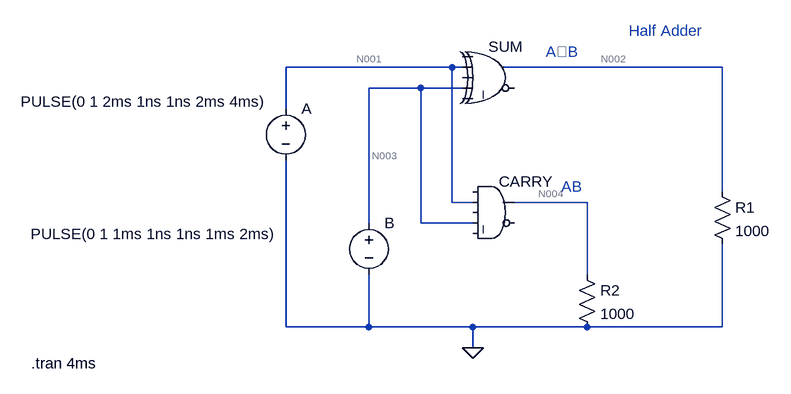
[diagram p0: schematic HALF ADDER_GOKUL.asc]
HALF ADDER_GOKUL.asc, the LTspice schematic file:
Version 4
SHEET 1 880 680
WIRE -64 -48 -320 -48
WIRE -48 -48 -64 -48
WIRE 352 -48 16 -48
WIRE -112 -16 -192 -16
WIRE -48 -16 -112 -16
WIRE -320 16 -320 -48
WIRE 352 144 352 -48
WIRE -64 160 -64 -48
WIRE -32 160 -64 160
WIRE 144 160 32 160
WIRE -192 192 -192 -16
WIRE -112 192 -112 -16
WIRE -32 192 -112 192
WIRE 144 272 144 160
WIRE -320 352 -320 96
WIRE -192 352 -192 272
WIRE -192 352 -320 352
WIRE -32 352 -192 352
WIRE 144 352 -32 352
WIRE 352 352 352 224
WIRE 352 352 144 352
WIRE -32 384 -32 352
FLAG -32 384 0
SYMBOL res 336 128 R0
SYMATTR InstName R1
SYMATTR Value 1000
SYMBOL res 128 256 R0
SYMATTR InstName R2
SYMATTR Value 1000
SYMBOL Digital\\xor 0 -96 R0
SYMATTR InstName SUM
SYMBOL Digital\\and 0 112 R0
SYMATTR InstName CARRY
SYMBOL voltage -320 0 R0
WINDOW 3 -408 5 Left 2
WINDOW 123 0 0 Left 0
WINDOW 39 0 0 Left 0
SYMATTR Value PULSE(0 1 2ms 1ns 1ns 2ms 4ms)
SYMATTR InstName A
SYMBOL voltage -192 176 R0
WINDOW 3 -521 33 Left 2
WINDOW 123 0 0 Left 0
WINDOW 39 0 0 Left 0
SYMATTR Value PULSE(0 1 1ms 1ns 1ns 1ms 2ms)
SYMATTR InstName B
TEXT 80 -72 Left 2 ;A⊕B
TEXT 104 136 Left 2 ;AB
TEXT -712 408 Left 2 !.tran 4ms
TEXT 208 -104 Left 2 ;Half Adder

The netlist it stands for:
* HALF ADDER_GOKUL.asc
R1 N002 0 1000
R2 N004 0 1000
A§SUM 0 N001 0 N003 0 0 N002 0 XOR
A§CARRY 0 N001 0 N003 0 0 N004 0 AND
V§A N001 0 PULSE(0 1 2ms 1ns 1ns 2ms 4ms)
V§B N003 0 PULSE(0 1 1ms 1ns 1ns 1ms 2ms)
* A⊕B
* AB
.tran 4ms
* Half Adder
.backanno
.end

* Results of the author's LTspice run, read from the files saved beside the schematic
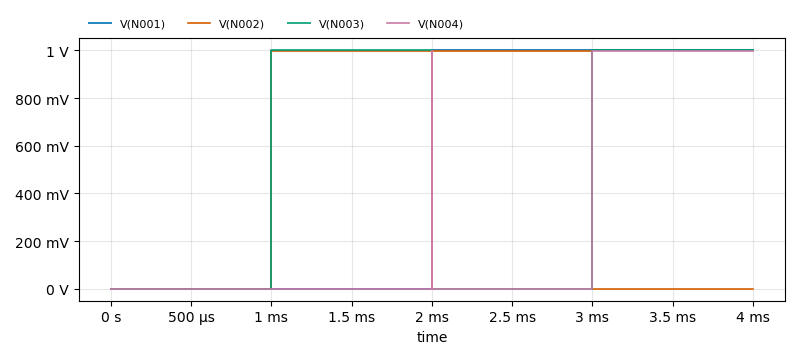
[diagram p1: Transient Analysis of HALF ADDER_GOKUL.asc, plotted from the saved traces]
* Transient Analysis, 1 run:
*   V(N001): min 0 V, max 1 V, average 500 mV, rms 707.1 mV, last 1 V
*   V(N002): min 0 V, max 999 mV, average 499.5 mV, rms 706.4 mV, last 0 V
*   V(N003): min 0 V, max 1 V, average 500 mV, rms 707.1 mV, last 1 V
*   V(N004): min 0 V, max 999 mV, average 249.8 mV, rms 499.5 mV, last 999 mV